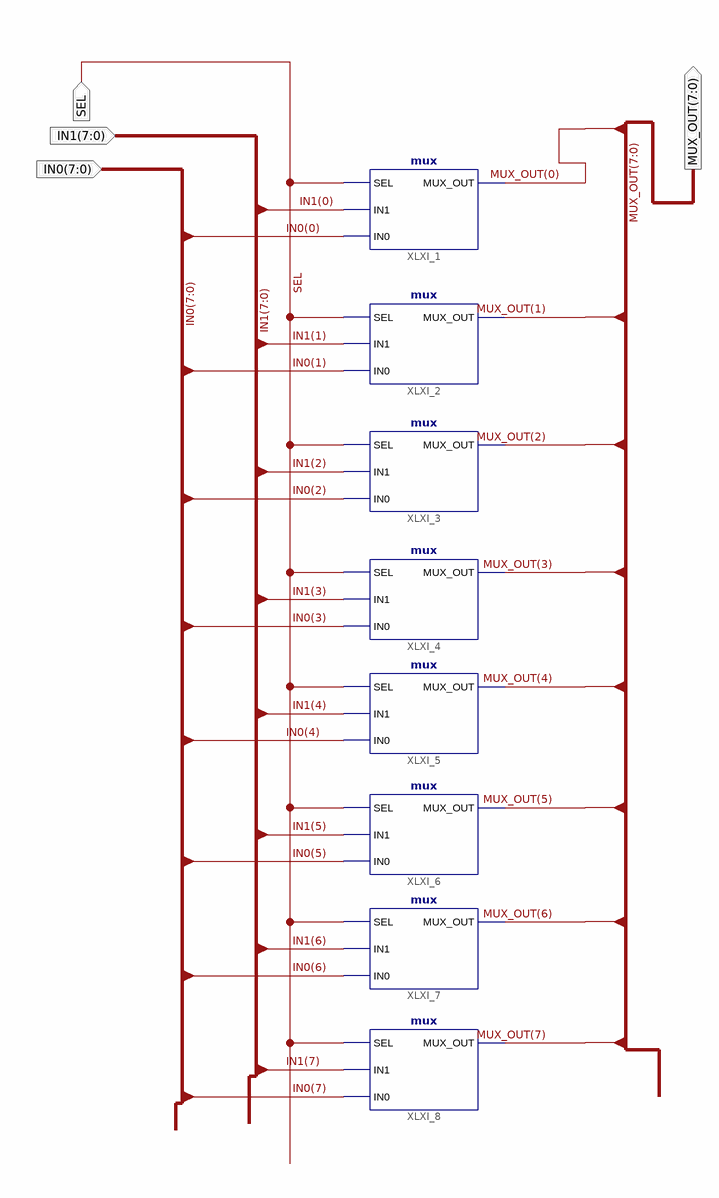
[diagram p0: schematic sheet 1]
// Xilinx ISE schematic mux8sch.sch (spartan3e) as structural Verilog: 8 symbols, 4 ports
module mux8sch (
  input  SEL,
  input  [7:0] IN1,
  input  [7:0] IN0,
  output [7:0] MUX_OUT
);

  mux XLXI_1 (.SEL(SEL), .IN1(IN1[0]), .IN0(IN0[0]), .MUX_OUT(MUX_OUT[0]));
  mux XLXI_2 (.SEL(SEL), .IN1(IN1[1]), .IN0(IN0[1]), .MUX_OUT(MUX_OUT[1]));
  mux XLXI_3 (.SEL(SEL), .IN1(IN1[2]), .IN0(IN0[2]), .MUX_OUT(MUX_OUT[2]));
  mux XLXI_4 (.SEL(SEL), .IN1(IN1[3]), .IN0(IN0[3]), .MUX_OUT(MUX_OUT[3]));
  mux XLXI_5 (.SEL(SEL), .IN1(IN1[4]), .IN0(IN0[4]), .MUX_OUT(MUX_OUT[4]));
  mux XLXI_6 (.SEL(SEL), .IN1(IN1[5]), .IN0(IN0[5]), .MUX_OUT(MUX_OUT[5]));
  mux XLXI_7 (.SEL(SEL), .IN1(IN1[6]), .IN0(IN0[6]), .MUX_OUT(MUX_OUT[6]));
  mux XLXI_8 (.SEL(SEL), .IN1(IN1[7]), .IN0(IN0[7]), .MUX_OUT(MUX_OUT[7]));
endmodule
